# EAGLE design dron alaplap (EAGLE 9.6.2)
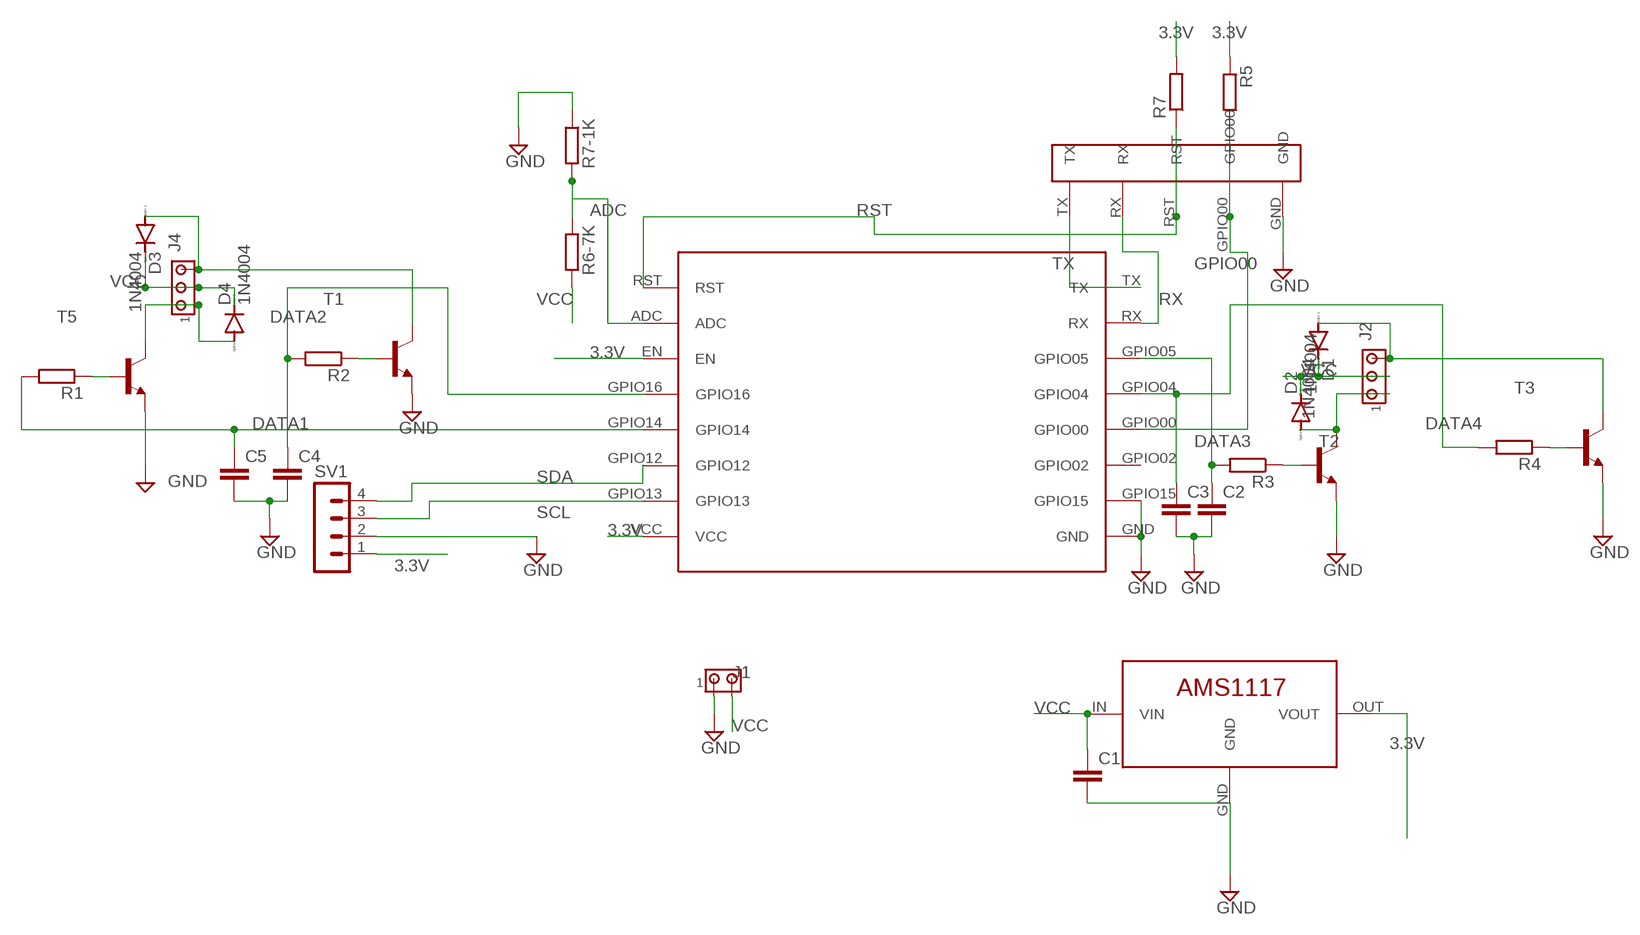
[diagram p0: schematic, sheet 1]

## Parts
C1  C-EU025-050X050  [C025-050X050]
C2  C-EU025-030X050  [C025-030X050]
C3  C-EU025-030X050  [C025-030X050]
C4  C-EU025-030X050  [C025-030X050]
C5  C-EU050-025X075  [C050-025X075]
D1  1N4004  [DO41-10]
D2  1N4004  [DO41-10]
D3  1N4004  [DO41-10]
D4  1N4004  [DO41-10]
J1  MTA02-156  [1X2MTA]
J2  MTA03-156  [1X3MTA]
J4  MTA03-156  [1X3MTA]
R1  R-EU_0207/12  [0207/12]
R2  R-EU_0207/12  [0207/12]
R3  R-EU_0207/12  [0207/12]
R4  R-EU_0207/12  [0207/12]
R5  R-EU_0207/12  [0207/12]
R6-7K  R-EU_0207/12  [0207/12]
R7  R-EU_0207/15  [0207/15]
R7-1K  R-EU_0207/12  [0207/12]
SV1  MA04-1  [MA04-1]
T1  2N2222-NPN-TO92-EBC  [TO92-EBC]
T2  2N2222-NPN-TO92-EBC  [TO92-EBC]
T3  2N2222-NPN-TO92-EBC  [TO92-EBC]
T5  2N2222-NPN-TO92-EBC  [TO92-EBC]
U$1  AMS1117  [AMS1117]
U$2  ESP8266  [ESP8266]
U$3  PIN  [PIN]

## Nets
3.3V: R5.1 R7.2 SV1.1 U$1.OUT(VOUT) U$2.EN U$2.VCC
ADC: R6-7K.1 R7-1K.2 U$2.ADC
DATA1: C5.1 R1.2 U$2.GPIO14
DATA2: C4.1 R2.2 U$2.GPIO16
DATA3: C2.1 R3.2 U$2.GPIO05
DATA4: C3.1 R4.2 U$2.GPIO04
GND: C1.2 C2.2 C3.2 C4.2 C5.2 J1.1 R7-1K.1 SV1.2 T1.E T2.E T3.E T5.E U$1.GND U$2.GND U$2.GPIO15 U$3.GND
GPIO00: R5.2 U$2.GPIO00 U$3.GPIO00
N$1: D4.A J4.1 T5.C
N$2: D2.A J2.1 T2.C
N$3: R1.1 T5.B
N$4: D3.A J4.3 T1.C
N$6: R2.1 T1.B
N$7: R3.1 T2.B
N$8: D1.A J2.3 T3.C
N$10: R4.1 T3.B
RST: R7.1 U$2.RST U$3.RST
RX: U$2.RX U$3.RX
SCL: SV1.3 U$2.GPIO13
SDA: SV1.4 U$2.GPIO12
TX: U$2.TX U$3.TX
VCC: C1.1 D1.C D2.C D3.C D4.C J1.2 J2.2 J4.2 R6-7K.2 U$1.IN(VIN)
Unconnected: U$2.GPIO02

## Library data of the parts
C1-C5 = rcl:C-EU: CAPACITOR, European symbol; SPICEPREFIX: C
D1-D4 = diode:1N4004: DIODE general purpose rectifier, 1 A
J1 = con-amp:MTA02-156: AMP connector
J2 J4 = con-amp:MTA03-156: AMP connector
R1-R5 R6-7K R7 R7-1K = rcl:R-EU_: RESISTOR, European symbol; SPICEPREFIX: R
SV1 = con-lstb:MA04-1: PIN HEADER; OC_FARNELL: unknown; OC_NEWARK: unknown
T1-T3 T5 = transistor-neu-to92:*-NPN-: NPN Transistror
U$1 = MyLIB:AMS1117
U$2 = MyLIB:ESP8266
U$3 = MyLIB:PIN: Ez egy csatlakozó. Nem találtam hasonlót a könyvtárak között.

## Board
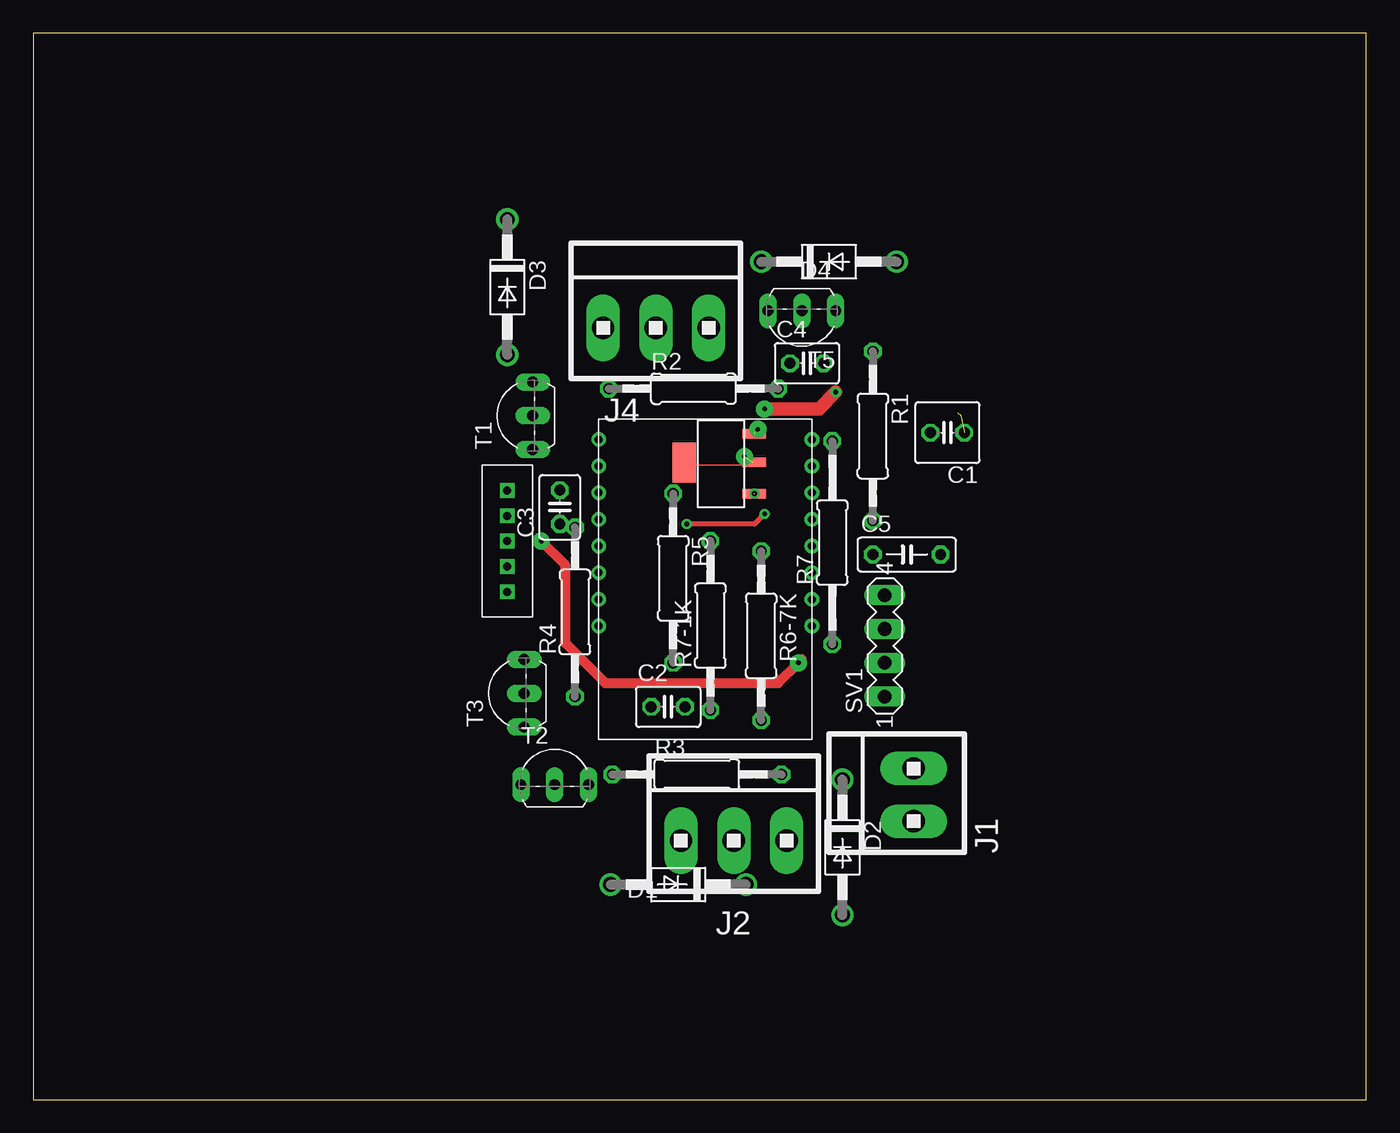
[diagram p1: board, top side]
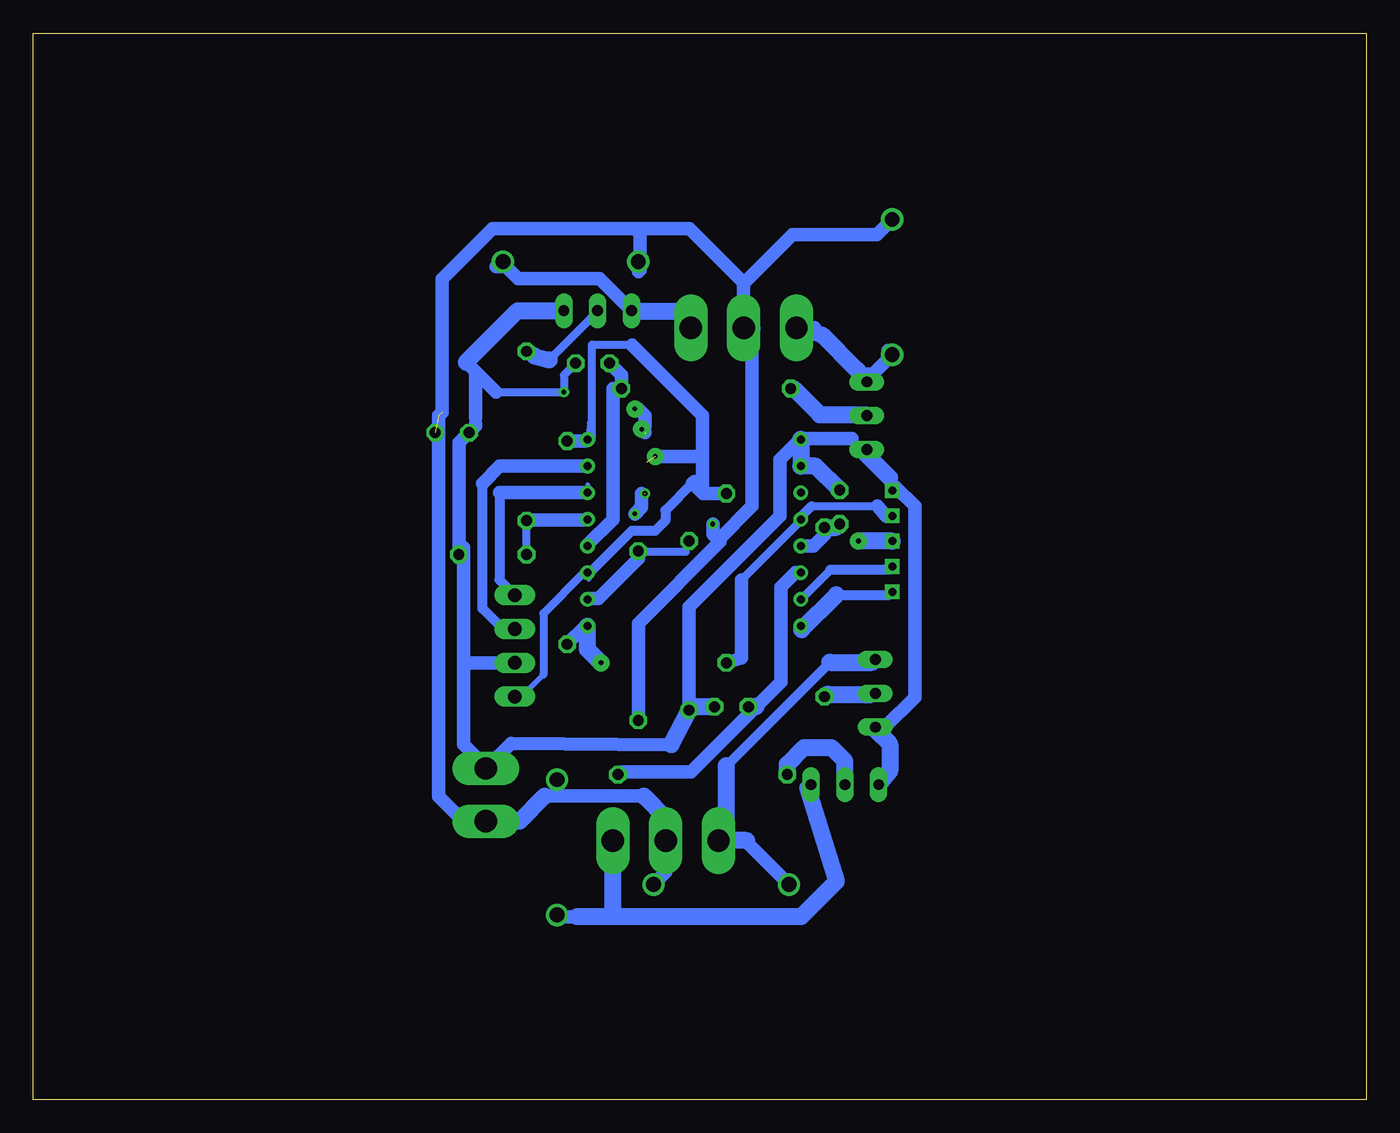
[diagram p2: board, bottom side, seen from below]

Size 100 x 80 mm. Coordinates in mm from the lower left corner, seen from the top.
Outline: 0,0 100,0 100,80 0,80 0,0
Copper layers (1*16): Top 0.035mm / dielectric 1.5mm / Bottom 0.035mm
Design rules "default *": minimum track width 40mil, minimum drill 0.35mm, track to track 6mil, track to pad 6mil, pad to pad 6mil, via to via 6mil, smd to smd 6mil, copper to edge 40mil, drill to drill 6mil, minimum pad ring 10mil, minimum via ring 8mil, stop-mask expansion 4mil, vias tented up to drill 0mil, thermal gap 10mil

### Footprints (pad centres in the part's own frame; a part is rotated, then mirrored left to right if it is on the bottom)
C025-050X050 = drill 0.813 octagon: 1 -1.27,0; 2 1.27,0
C025-030X050 = drill 0.813 octagon: 1 -1.27,0; 2 1.27,0
C050-025X075 = drill 0.813 octagon: 1 -2.54,0; 2 2.54,0
DO41-10 = drill 1.118: A 5.08,0; C -5.08,0
1X2MTA = drill 1.676 long: 1 1.981,0; 2 -1.981,0
1X3MTA = drill 1.676 long: 1 3.937,0; 2 -0.025,0; 3 -3.988,0
0207/12 = drill 0.813 octagon: 1 -6.35,0; 2 6.35,0
0207/15 = drill 0.813 octagon: 1 -7.62,0; 2 7.62,0
MA04-1 = drill 1.016 long: 1 -3.81,0; 2 -1.27,0; 3 1.27,0; 4 3.81,0
TO92-EBC = drill 0.813 long: B 0,-1.27; C 2.54,-1.27; E -2.54,-1.27
AMS1117 = smd 0.7 x 1.75: GND 5.5,-0.75; IN 1,-0.75; OUT 3.35,-0.75 | smd 3 x 1.75: OUT2 3.35,4.5
ESP8266 = drill 0.6: ADC 0,12; EN 0,10; GND 16,0; GPIO00 16,6; GPIO02 16,4; GPIO04 16,8; GPIO05 16,10; GPIO12 0,4; GPIO13 0,2; GPIO14 0,6; GPIO15 16,2; GPIO16 0,8; RST 0,14; RX 16,12; TX 16,14; VCC 0.003,0.012
PIN = drill 0.6 square: GND 7.6,0; GPIO00 5.7,0; RST 3.8,0; RX 1.9,0; TX 0,0

### Placement (x,y rotation side)
C1  68.58,50.04 180 top
C2  47.62,29.46 0 top
C3  39.5,44.45 90 top
C4  58.04,55.24 0 top
C5  65.53,40.89 0 top
D1  48.39,16.13 180 top
D2  60.71,18.92 270 top
D3  35.56,60.96 270 top
D4  59.69,62.87 0 top
J1  66.04,22.86 90 top
J2  52.58,19.43 0 top
J4  46.74,57.91 0 top
R1  62.99,49.78 270 top
R2  49.53,53.34 0 top
R3  49.78,24.38 0 top
R4  40.64,36.58 90 top
R5  48.01,39.12 270 top
R6-7K  54.61,34.8 270 top
R7  59.94,41.78 90 top
R7-1K  50.8,35.56 90 top
SV1  63.88,34.04 90 top
T1  36.2,51.31 90 top
T2  39.12,24.89 0 top
T3  35.56,30.48 90 top
T5  57.66,57.91 180 top
U$1  53.34,44.45 90 top
U$2  58.42,49.53 180 top
U$3  35.56,38.1 90 top

### Tracks (layer width: path | path; a pad name or v marks a point on that pad's centre or on a via)
3.3V  (via drill 0.35 pad 1.27)  (1 unrouted)
  Top 0.381: U$1.OUT 53.99,47.8
  Bottom 0.381: 58.67,39.47 U$2.EN 58.39,39.38 58.32,39.05 | 63.92,30.42 SV1.1 63.37,30.23 61.72,31.88 | 58.28,50.76 U$2.VCC | 49.81,45.53 50.53,46.25 | 49.81,48.07 50,48.26
  Bottom 0.61: U$2.EN 58.67,39.53 61.72,36.48 61.72,31.88 | U$2.VCC 58.1,49.52 58.1,56.64 58.04,56.64 57.99,56.59 55.07,56.59
  Bottom 0.762: 50.4,46.37 50.53,46.25 52.58,44.2 52.58,43.43 53.34,42.67 55.12,42.67 58.39,39.4 58.39,39.38
  Bottom 1.016: R5.1 49.75,45.47 50.53,46.25 | 49.81,45.78 50.4,46.37 | 50,48.26 v53.34,48.26 | 49.81,45.53 49.81,48.07 49.81,51.33 55.07,56.59 | U$2.VCC 58.53,49.4 R7.2
ADC
  Bottom 0.381: 58.41,37.6 U$2.ADC | 51.07,41.11 R7-1K.2 | 54.61,40.6 R6-7K.1
  Bottom 0.61: 54.61,40.6 54.1,41.11 51.07,41.11
  Bottom 1.016: 58.41,37.6 57.61,37.6 54.61,40.6
DATA1
  Bottom 0.381: R1.2 62.95,43.47 | 58.67,43.47 U$2.GPIO14
  Bottom 0.61: C5.1 R1.2
  Bottom 1.016: 62.95,43.47 58.67,43.47
DATA2
  Bottom 0.381: 58.41,41.63 58.41,41.6 U$2.GPIO16 | 56.52,53.34 R2.2
  Bottom 1.016: 58.41,41.63 56.52,43.52 56.52,53.34 | R2.2 55.88,54.36 C4.1
DATA3
  Bottom 1.016: U$2.GPIO05 42.83,39.53 43.9,38.46 43.9,31.34 45.75,29.5 50.66,24.59 55.93,24.59 R3.2
  Bottom 1.27: C2.1 45.78,29.46 45.75,29.5
DATA4
  Bottom 1.016: R4.2 40.64,42.35 41.47,41.53 U$2.GPIO04
  Bottom 1.27: R4.2 39.75,42.93 C3.1
GND  (via drill 0.35, 0.35 pad 1.27)  (1 unrouted)
  Top 0.381: v54.86,51.82 54.61,51.82
  Top 1.016: v60.2,53.09 58.93,51.82 v54.86,51.82
  Bottom 0.381: 66.14,25.07 J1.1 | 36.8,27.74 T3.E | 35.74,45.87 U$3.GND | 42.41,49.61 U$2.GND 42.67,49.34 | 38.58,49.61 T1.E | v60.2,53.09 59.94,53.09
  Bottom 0.61: 65.28,53.09 v60.2,53.09 60.2,54.36 C4.2 | C5.2 68.07,41.4 67.72,41.4
  Bottom 0.762: 35.74,46.63 35.74,45.87 | 66.8,50.67 66.8,51.16 66.83,51.18
  Bottom 1.016: 67.72,32.77 67.72,26.64 66.14,25.07 | 67.72,32.77 67.72,41.4 | 66.83,51.18 66.83,54.63 | T1.E 37.47,48.36 | 38.58,49.61 42.41,49.61 | R7-1K.1 50.8,36.94 43.98,43.76 43.98,48.03 42.67,49.34 | T3.E 36.11,27.94 33.87,30.18 33.87,44.51 35.31,45.95 U$3.GND | 52.14,26.62 64.15,26.73 J1.1 | SV1.2 67.72,32.77 | 67.52,55.33 66.83,54.63 | 66.83,54.63 65.28,53.09 | v54.86,51.82 54.61,51.82 54.1,51.31 54.1,50.55 v54.36,50.29 54.1,50.04 | C5.2 68.07,49.28 C1.2 66.8,50.55 66.8,50.67
  Bottom 1.27: 67.52,55.33 63.66,59.18 T5.E | 36.8,27.74 35.74,26.67 35.74,24.64 T2.E | 37.47,48.36 35.74,46.63 | 52.14,26.62 R7-1K.1 50.55,29.46 C2.2 | U$2.GND U$2.GPIO15 41.31,47.53 C3.2
GPIO00
  Bottom 0.381: 42.67,43.47 U$2.GPIO00 42.41,43.74
  Bottom 0.61: 42.67,43.47 42.67,43.18 46.88,38.98 | 41.62,44.53 36.66,44.53 | 36.03,43.8 U$3.GPIO00
  Bottom 0.762: 42.41,43.74 41.62,44.53
  Bottom 1.016: 46.88,38.98 46.88,33.14 R5.2 | 36.66,44.53 36.03,43.8
N$1
  Bottom 0.381: 55.09,59.12 T5.C
  Bottom 1.016: 65.15,62.48 64.52,62.48 63.63,61.59 57.53,61.59 T5.C | D4.A 65.15,62.48 | 65.15,62.48 65.28,62.48
  Bottom 1.27: 55.09,59.12 51.3,59.12 51.26,58.5 J4.1
N$2
  Bottom 1.016: 59.18,13.72 60.58,13.72 D2.A
  Bottom 1.27: 56.52,13.72 42.39,13.72 39.75,16.36 41.91,23.36 41.91,23.37 T2.C | 56.52,13.72 J2.1 | 56.52,13.72 59.18,13.72
N$3
  Bottom 0.61: 61.3,55.48 57.66,59.13
  Bottom 1.016: 62.43,55.79 R1.1
  Bottom 1.27: 62.43,55.79 61.3,55.48 | 57.66,59.13 T5.B
N$4
  Bottom 0.381: 38.06,54.8 37.83,54.42 T1.C
  Bottom 1.016: 35.87,56.19 D3.A 37.02,54.42 37.83,54.42 | J4.3 41.4,57.91 | 38.06,54.8 38.27,54.8
  Bottom 1.27: 38.27,54.8 40.8,57.34 J4.3
N$6
  Bottom 0.381: 37.5,51.38 T1.B | 42.94,53.34 R2.1
  Bottom 1.27: 37.5,51.38 40.98,51.38 42.94,53.34
N$7
  Bottom 1.27: T2.B 39.12,25.4 40.13,26.42 42.16,26.42 43.43,25.15 R3.1
N$8
  Bottom 0.381: 37.07,32.8 T3.C
  Bottom 0.762: 48.01,25.04 40.25,32.8 | J2.3 48.01,20.02
  Bottom 1.016: D1.A 46.61,19.43 J2.3
  Bottom 1.27: 40.25,32.8 37.07,32.8 | 48.01,20.02 48.01,25.04 | 46.48,19.43 J2.3
N$10
  Bottom 0.381: 37.07,30.4 T3.B | 40.4,30.4 R4.1
  Bottom 1.27: 40.4,30.4 37.07,30.4
RST  (via drill 0.35 pad 1.27)
  Top 0.762: v38.1,41.91 39.88,40.13 39.88,34.29 42.93,31.24 55.88,31.24 v57.4,32.77 57.66,33.02
  Bottom 0.381: 58.62,35.48 U$2.RST
  Bottom 0.762: v38.09,41.9 v38.1,41.91
  Bottom 1.016: R7.1 58.62,35.48
  Bottom 1.27: U$3.RST v38.09,41.9 | v57.4,32.77 58.42,33.78 U$2.RST
RX
  Bottom 0.381: 42.34,37.6 42.41,37.6 U$2.RX | 35.74,39.74 U$3.RX
  Bottom 0.61: 40.21,39.74 42.34,37.6
  Bottom 0.762: 35.74,39.74 40.21,39.74
SCL
  Bottom 0.381: 58.67,47.47 58.48,47.52 U$2.GPIO13
  Bottom 0.762: SV1.3 64.77,35.31 66.29,36.83 66.29,46.23
  Bottom 1.016: 66.29,46.23 65.01,47.52 58.48,47.52
SDA
  Bottom 0.381: 58.41,46.14 58.41,45.61 U$2.GPIO12
  Bottom 0.762: 65.02,45.53 65.02,38.99 SV1.4
  Bottom 1.016: 65.02,45.53 U$2.GPIO12
TX
  Bottom 0.381: 35.74,37.87 U$3.TX | 42.35,35.27 U$2.TX
  Bottom 0.762: 39.75,37.87 35.74,37.87
  Bottom 1.27: 42.35,35.27 39.75,37.87
VCC  (via drill 0.35)  (3 unrouted)
  Top 0.381: v49.02,43.18 54.1,43.18 v54.86,43.94 55.12,43.94
  Bottom 0.381: 54.36,45.47 v54.1,45.47
  Bottom 1.016: 61.63,22.77 60.71,22.77 | 60.71,22.77 54.19,22.77 | 63.52,20.88 J1.2 67.73,20.88 69.58,22.73 69.58,51.31 | R6-7K.2 54.61,35.71 48.46,41.86 48.59,41.99 | 48.59,41.99 46.06,44.51 46.06,57.84 | 69.33,51.56 69.33,61.56 65.55,65.34 54.86,65.34 | 54.48,65.34 50.77,65.34 46.71,61.28 J4.2 46.71,61.21 43.03,64.9 36.7,64.9 D3.C | 54.48,65.34 54.86,65.34 | 48.59,41.99 49.02,42.42 v49.02,43.18 | v54.86,43.94 54.36,44.45 54.36,45.47 | 54.48,64.96 54.86,65.34 | D1.C 52.55,17.04 J2.2 | 60.71,22.77 D2.C | 54.48,65.34 54.48,62.23 54.61,62.1 D4.C
  Bottom 1.27: 54.19,22.77 52.55,21.13 J2.2 52.55,17.42 | 63.52,20.88 61.63,22.77 | 46.06,57.84 J4.2